# EAGLE design NPMDriver (EAGLE 6.5.0)
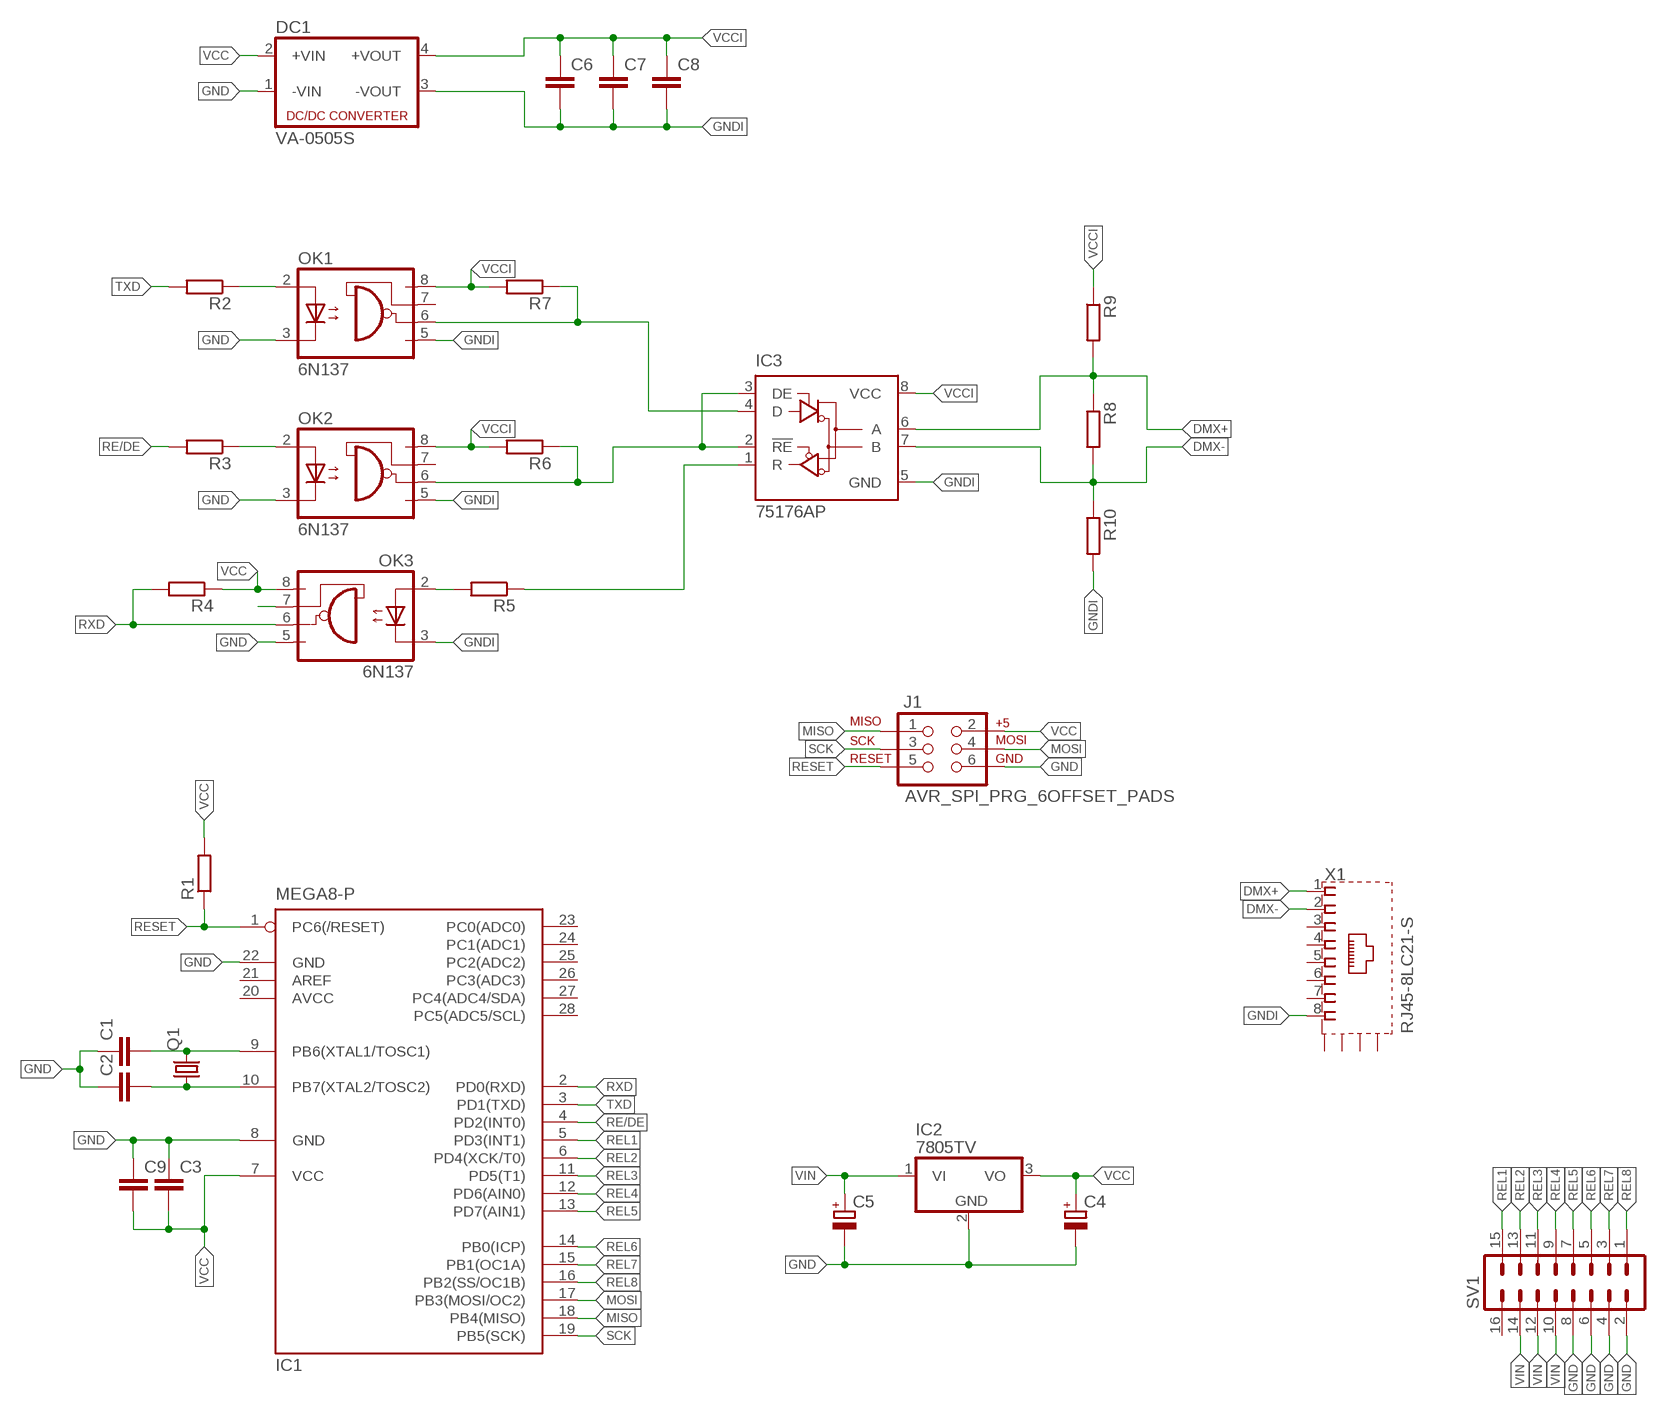
[diagram p0: schematic, sheet 1]

## Parts
C1  C-EU025-025X050  [C025-025X050]
C2  C-EU025-025X050  [C025-025X050]
C3  C-EU050-035X075  [C050-035X075]
C4  CPOL-EUE5-8.5  [E5-8,5]
C5  CPOL-EUE5-8.5  [E5-8,5]
C6  C-EU050-035X075  [C050-035X075]
C7  C-EU050-035X075  [C050-035X075]
C8  C-EU050-035X075  [C050-035X075]
C9  C-EU050-035X075  [C050-035X075]
DC1  VA-0505S  [4SIL]
IC1  MEGA8-P  [DIL28-3]
IC2  7805TV  [TO220V]
IC3  75176AP  [DIL08]
J1  AVR_SPI_PRG_6OFFSET_PADS  [2X3_OFFSET]
OK1  6N137  [DIL08]
OK2  6N137  [DIL08]
OK3  6N137  [DIL08]
Q1  CRYSTALHC49S  [HC49/S]
R1  R-EU_0207/10  [0207/10]
R2  R-EU_0207/10  [0207/10]
R3  R-EU_0207/10  [0207/10]
R4  R-EU_0207/10  [0207/10]
R5  R-EU_0207/10  [0207/10]
R6  R-EU_0207/10  [0207/10]
R7  R-EU_0207/10  [0207/10]
R8  R-EU_0207/10  [0207/10]
R9  R-EU_0207/10  [0207/10]
R10  R-EU_0207/10  [0207/10]
SV1  ML163M  [3M_16]
X1  RJ45-8LC21-S  [RJ45-SHIELD1]

## Nets
DMX+: IC3.6(A) R8.1 R9.2 X1.1
DMX-: IC3.7(B) R8.2 R10.1 X1.2
GND: C1.1 C2.1 C3.1 C4.- C5.- C9.1 DC1.1(-VIN) IC1.8(GND) IC1.22(GND) IC2.2(GND) J1.6 OK1.3(C) OK2.3(C) OK3.5(GND) SV1.2 SV1.4 SV1.6 SV1.8
GNDI: C6.2 C7.2 C8.2 DC1.3(-VOUT) IC3.5(GND) OK1.5(GND) OK2.5(GND) OK3.3(C) R10.2 X1.8
MISO: IC1.18(PB4(MISO)) J1.1
MOSI: IC1.17(PB3(MOSI/OC2)) J1.4
N$1: C2.2 IC1.10(PB7(XTAL2/TOSC2)) Q1.1
N$2: C1.2 IC1.9(PB6(XTAL1/TOSC1)) Q1.2
N$3: OK1.2(A) R2.1
N$4: OK3.2(A) R5.2
N$5: OK2.2(A) R3.1
N$6: OK3.7(VE)
N$7: IC3.1(R) R5.1
N$8: IC3.4(D) OK1.6(VO) R7.1
N$9: IC3.2(!RE) IC3.3(DE) OK2.6(VO) R6.1
RE/DE: IC1.4(PD2(INT0)) R3.2
REL1: IC1.5(PD3(INT1)) SV1.15
REL2: IC1.6(PD4(XCK/T0)) SV1.13
REL3: IC1.11(PD5(T1)) SV1.11
REL4: IC1.12(PD6(AIN0)) SV1.9
REL5: IC1.13(PD7(AIN1)) SV1.7
REL6: IC1.14(PB0(ICP)) SV1.5
REL7: IC1.15(PB1(OC1A)) SV1.3
REL8: IC1.16(PB2(SS/OC1B)) SV1.1
RESET: IC1.1(PC6(/RESET)) J1.5 R1.1
RXD: IC1.2(PD0(RXD)) OK3.6(VO) R4.2
SCK: IC1.19(PB5(SCK)) J1.3
TXD: IC1.3(PD1(TXD)) R2.2
VCC: C3.2 C4.+ C9.2 DC1.2(+VIN) IC1.7(VCC) IC2.3(VO) J1.2 OK3.8(VCC) R1.2 R4.1
VCCI: C6.1 C7.1 C8.1 DC1.4(+VOUT) IC3.8(VCC) OK1.8(VCC) OK2.8(VCC) R6.2 R7.2 R9.1
VIN: C5.+ IC2.1(VI) SV1.10 SV1.12 SV1.14
Unconnected: IC1.21(AREF) IC1.23(PC0(ADC0)) IC1.24(PC1(ADC1)) IC1.25(PC2(ADC2)) IC1.26(PC3(ADC3)) IC1.27(PC4(ADC4/SDA)) IC1.28(PC5(ADC5/SCL)) OK1.7(VE) OK2.7(VE) SV1.16 X1.3 X1.4 X1.5 X1.6 X1.7 X1.S1(S) X1.S2(S) X1.S3(S) X1.S4(S)

## Power pins joined to a net without a drawn wire
AVCC: IC1.20(AVCC)

## Library data of the parts
C1-C3 C6-C9 = rcl:C-EU: CAPACITOR, European symbol
C4 C5 = rcl:CPOL-EU: POLARIZED CAPACITOR, European symbol
DC1 = dc-dc-converter:VA-*?: DC DC Converter Single Output, 1 Watt Motien Technology Co.,Ltd. Source: va-serie.pdf; OC_FARNELL: unknown; OC_NEWARK: unknown
IC1 = atmel:MEGA8-P: MICROCONTROLLER 8 Kbytes FLASH, 1 kbytes SRAM, 512 bytes EEPROM, USART, 4-channel 10 bit ADC, 2-channel 8 bit ADC Pin compatible with Atmega48, ATMega88, ATMega168 Source: avr.lbr; OC_FARNELL: unknown; OC_NEWARK: unknown
IC2 = linear:78*: Positive VOLTAGE REGULATOR Source: http://cache.national.com/ds/LM/LM78L05.pdf http://www.fairchildsemi.com/ds/LM/LM7805.pdf
IC3 = 751xx:75176A: DIFFERENTIAL BUS TRANSCEIVER Source: http://focus.ti.com/lit/ds/symlink/sn75176a.pdf
J1 = SparkFun:AVR_SPI_PRG_6: AVR ISP 6 Pin This is the reduced ISP connector for AVR programming. Common on Arduino. This footprint will take up less PCB space and can be used with a 10-pin to 6-pin adapter such as SKU: BOB-08508
OK1-OK3 = optocoupler:6N137: MOTOROLA OPTO COUPLER; MPN: 6N137; OC_FARNELL: 1328376; OC_NEWARK: 52M1895
Q1 = crystal:CRYSTAL: CRYSTAL; OC_FARNELL: 1667008; OC_NEWARK: unknown
R1-R10 = rcl:R-EU_: RESISTOR, European symbol
SV1 = con-harting-ml:ML16: HARTING; OC_FARNELL: unknown; OC_NEWARK: unknown
X1 = con-tycoelectronics:RJ45*2: RJ45 Low Profile Shield Type 2 For all RJ45 L, LC, LCT and X Series Models Source: www.tycoelectronics.com .. ENG_DS_1654001_1099_RJ_L_0507.pdf; OC_FARNELL: unknown; OC_NEWARK: unknown

## Board
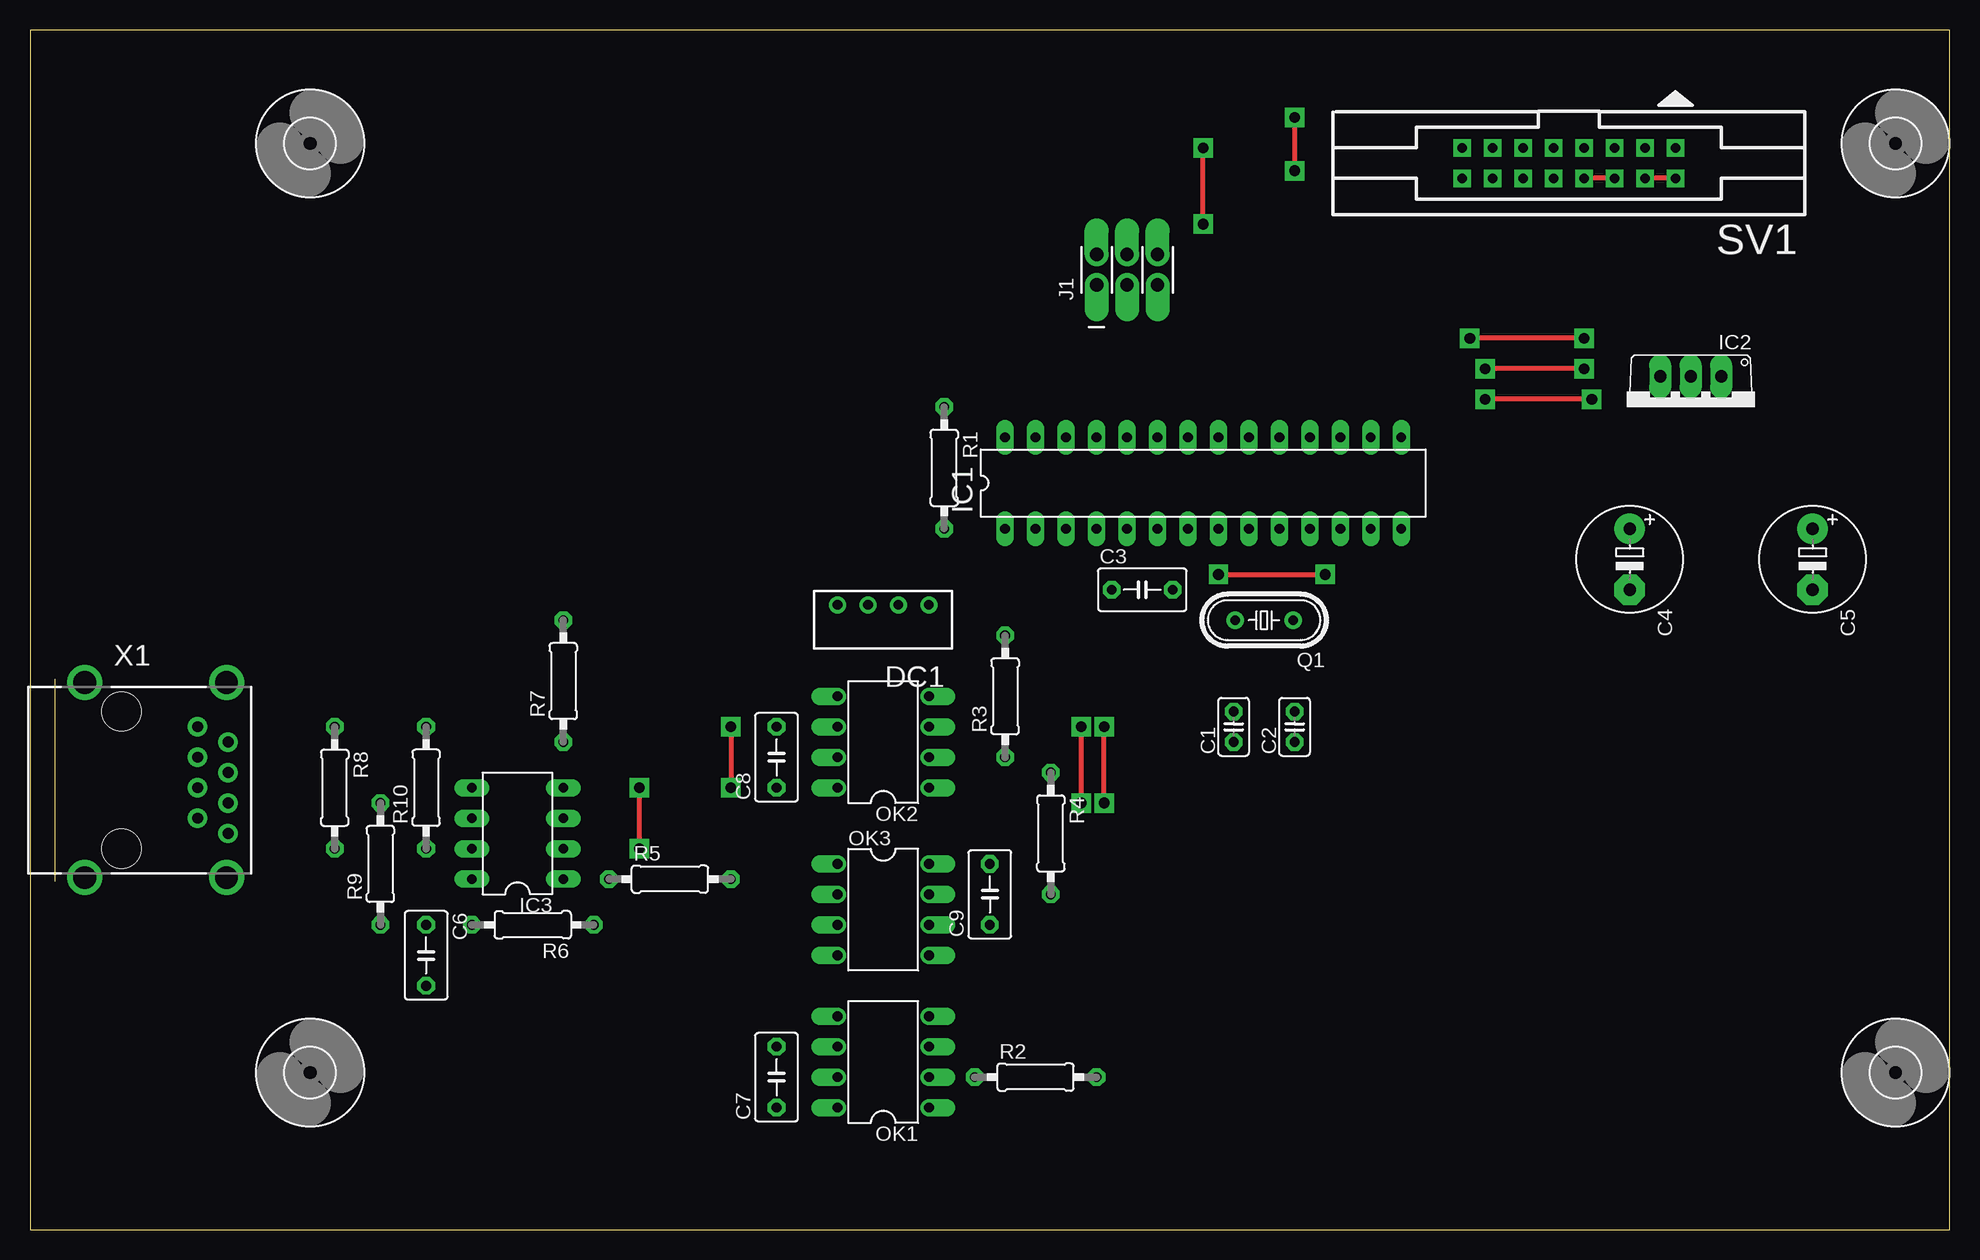
[diagram p1: board, top side]
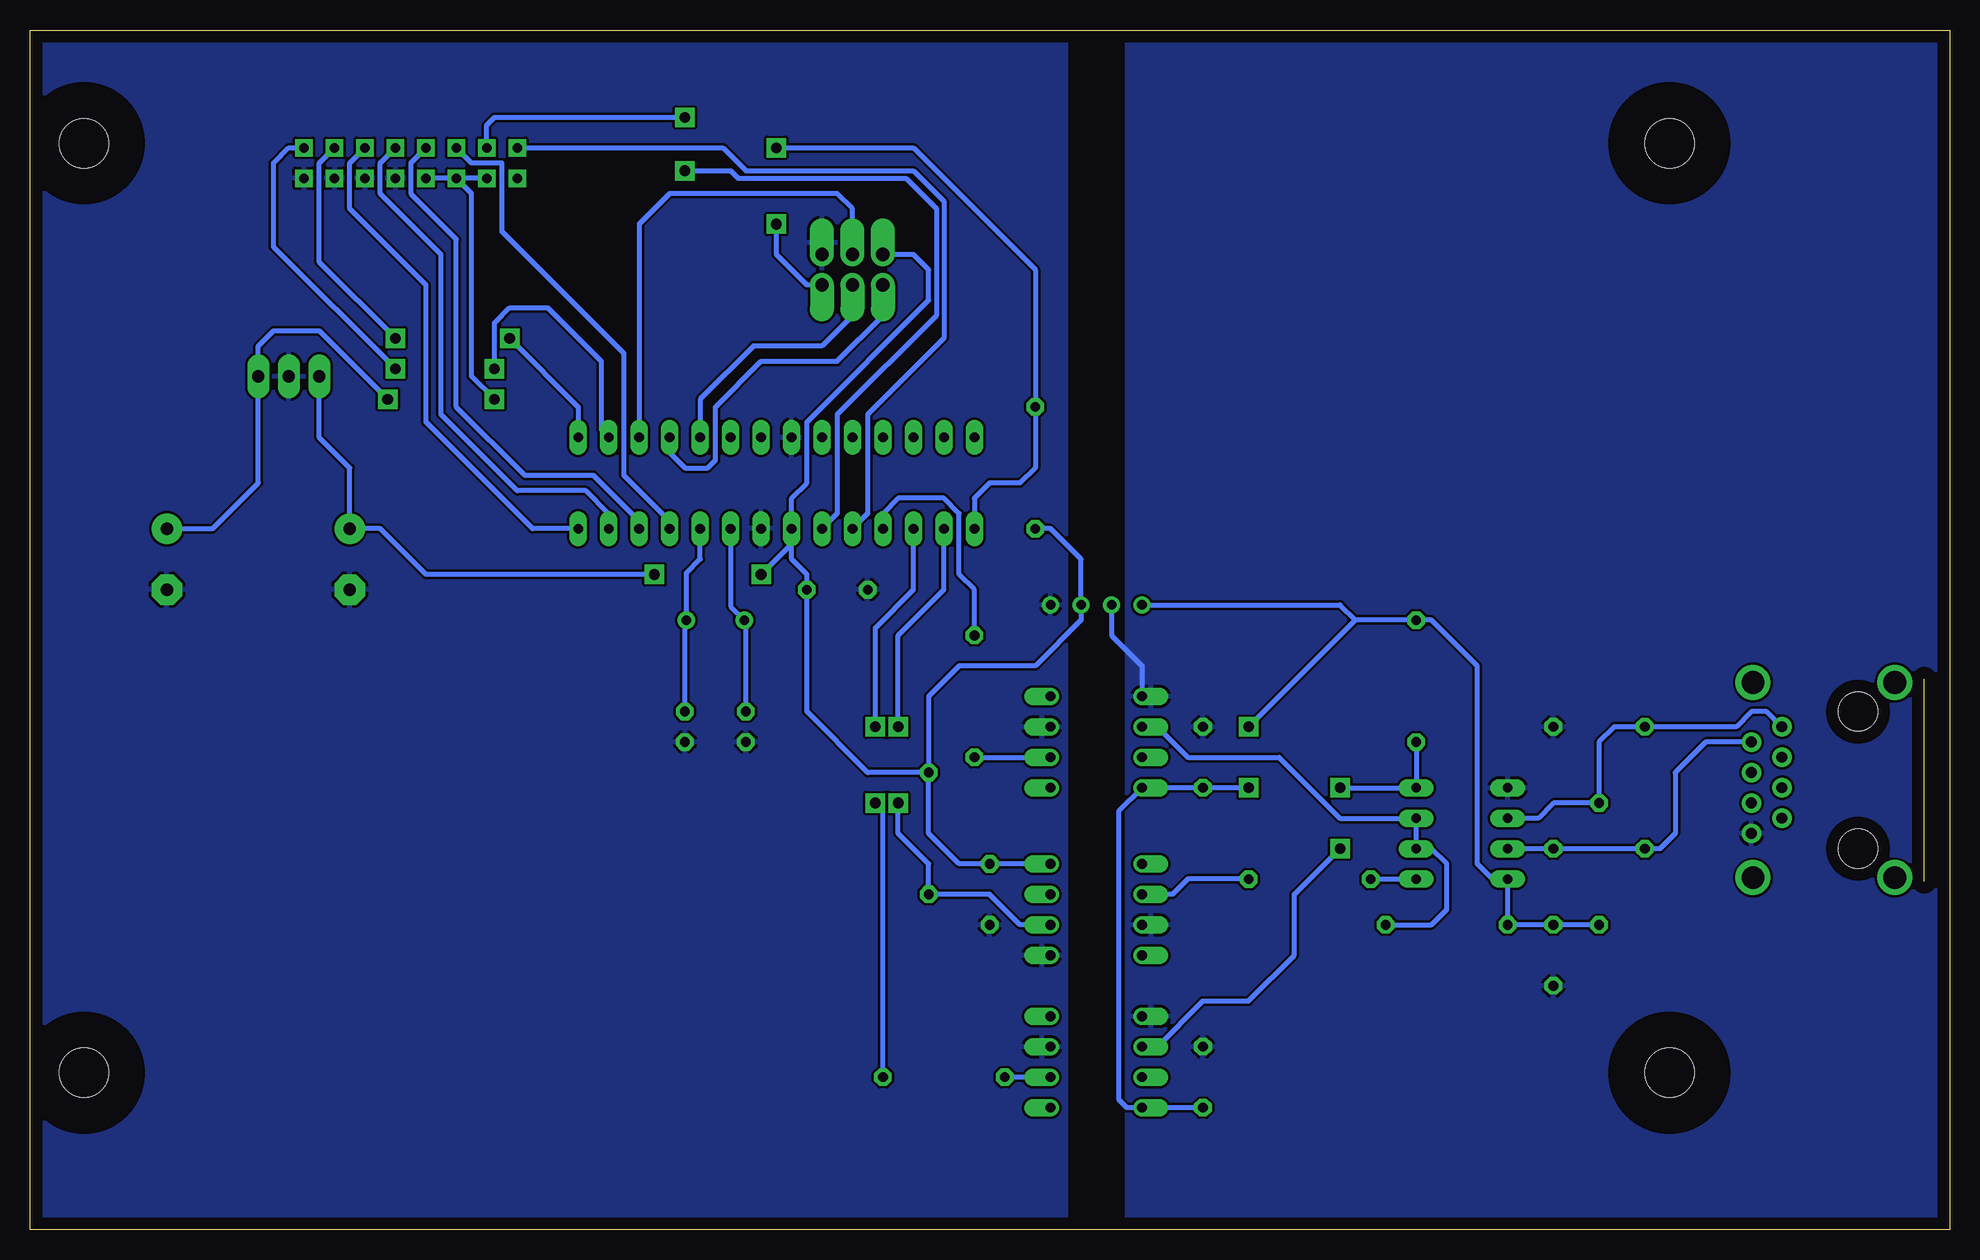
[diagram p2: board, bottom side, seen from below]

Size 160 x 100 mm. Coordinates in mm from the lower left corner, seen from the top.
Outline: 0,0 160,0 160,100 0,100 0,0
Copper layers (1*16): Top 0.035mm / dielectric 1.5mm / Bottom 0.035mm
Design rules "default *": minimum track width 10mil, minimum drill 24mil, track to track 8mil, track to pad 8mil, pad to pad 8mil, via to via 8mil, smd to smd 8mil, copper to edge 40mil, drill to drill 8mil, minimum pad ring 10mil, minimum via ring 10mil, stop-mask expansion 4mil, vias tented up to drill 0mil, thermal gap 10mil

### Footprints (pad centres in the part's own frame; a part is rotated, then mirrored left to right if it is on the bottom)
C025-025X050 = drill 0.813 octagon: 1 -1.27,0; 2 1.27,0
C050-035X075 = drill 0.813 octagon: 1 -2.54,0; 2 2.54,0
E5-8,5 = drill 1.016 pad 2.54: + -2.54,0 | drill 1.016 pad 2.54 octagon: - 2.54,0
4SIL = drill 0.8: 1 -3.81,0; 2 -1.27,0; 3 1.27,0; 4 3.81,0
DIL28-3 = drill 0.813 long: 1 -16.51,-3.81; 2 -13.97,-3.81; 3 -11.43,-3.81; 4 -8.89,-3.81; 5 -6.35,-3.81; 6 -3.81,-3.81; 7 -1.27,-3.81; 8 1.27,-3.81; 9 3.81,-3.81; 10 6.35,-3.81; 11 8.89,-3.81; 12 11.43,-3.81; 13 13.97,-3.81; 14 16.51,-3.81; 15 16.51,3.81; 16 13.97,3.81; 17 11.43,3.81; 18 8.89,3.81; 19 6.35,3.81; 20 3.81,3.81; 21 1.27,3.81; 22 -1.27,3.81; 23 -3.81,3.81; 24 -6.35,3.81; 25 -8.89,3.81; 26 -11.43,3.81; 27 -13.97,3.81; 28 -16.51,3.81
TO220V = drill 1.016 long: 1 -2.54,-2.54; 2 0,-2.54; 3 2.54,-2.54
DIL08 = drill 0.813 long: 1 -3.81,-3.81; 2 -1.27,-3.81; 3 1.27,-3.81; 4 3.81,-3.81; 5 3.81,3.81; 6 1.27,3.81; 7 -1.27,3.81; 8 -3.81,3.81
2X3_OFFSET = drill 1.118 pad 1.88 offset: 1 -2.54,-1.27; 2 -2.54,1.27; 3 0,-1.27; 4 0,1.27; 5 2.54,-1.27; 6 2.54,1.27
DIL08' = drill 0.813 offset: 1 -3.81,-3.81; 2 -1.27,-3.81; 3 1.27,-3.81; 4 3.81,-3.81; 5 3.81,3.81; 6 1.27,3.81; 7 -1.27,3.81; 8 -3.81,3.81
HC49/S = drill 0.813: 1 -2.413,0; 2 2.413,0
0207/10 = drill 0.813 octagon: 1 -5.08,0; 2 5.08,0
3M_16 = drill 0.813 square: 1 -8.89,-1.27; 2 -8.89,1.27; 3 -6.35,-1.27; 4 -6.35,1.27; 5 -3.81,-1.27; 6 -3.81,1.27; 7 -1.27,-1.27; 8 -1.27,1.27; 9 1.27,-1.27; 10 1.27,1.27; 11 3.81,-1.27; 12 3.81,1.27; 13 6.35,-1.27; 14 6.35,1.27; 15 8.89,-1.27; 16 8.89,1.27
4,1 = hole 4.1: 0,0
RJ45-SHIELD1 = drill 0.9 pad 1.4: 1 -4.445,6.35; 2 -3.175,8.89; 3 -1.905,6.35; 4 -0.635,8.89; 5 0.635,6.35; 6 1.905,8.89; 7 3.175,6.35; 8 4.445,8.89 | drill 1.9 pad 2.5: S1 -8.128,-3.048; S2 8.128,-3.048; S3 -8.128,8.76; S4 8.128,8.76 | hole 3.251: -5.715,0; 5.715,0

### Placement (x,y rotation side)
C1  100.33,41.91 90 top
C2  105.41,41.91 90 top
C3  92.71,53.34 0 top
C4  133.35,55.88 270 top
C5  148.59,55.88 270 top
C6  33.02,22.86 270 top
C7  62.23,12.7 90 top
C8  62.23,39.37 90 top
C9  80.01,27.94 90 top
DC1  71.12,52.07 180 top
IC1  97.79,62.23 0 top
IC2  138.43,68.58 180 top
IC3  40.64,33.02 90 top
J1  91.44,80.01 0 top
OK1  6N137  [DIL08']  71.12,13.97 90 top
OK2  6N137  [DIL08']  71.12,40.64 90 top
OK3  6N137  [DIL08']  71.12,26.67 270 top
Q1  102.87,50.8 180 top
R1  76.2,63.5 270 top
R2  83.82,12.7 0 top
R3  81.28,44.45 90 top
R4  85.09,33.02 270 top
R5  53.34,29.21 0 top
R6  41.91,25.4 180 top
R7  44.45,45.72 90 top
R8  25.4,36.83 270 top
R9  29.21,30.48 90 top
R10  33.02,36.83 90 top
SV1  128.27,88.9 180 top
U$1  [4,1]  23.35,90.55 0 top
U$2  [4,1]  155.5,90.55 0 top
U$3  [4,1]  23.35,13.08 0 top
U$4  [4,1]  155.5,13.08 0 top
X1  7.62,37.47 270 top

### Tracks (layer width: path | path; a pad name or v marks a point on that pad's centre or on a via)
DMX+
  Bottom 0.406: X1.1 15.24,43.18 16.51,43.18 17.78,41.91 R8.1 27.94,41.91 29.21,40.64 R9.2 33.02,35.56 34.29,34.29 IC3.6
DMX-
  Bottom 0.406: X1.2 20.32,40.64 22.86,38.1 22.86,33.02 24.13,31.75 R8.2 R10.1 IC3.7
GND
  Top 0.406: SV1.2 SV1.4 | SV1.6 SV1.8
  pour Bottom: 160.02,0 73.66,0 73.66,100.33 160.02,100.33
GNDI
  Bottom 0.406: DC1.3 69.85,49.53 67.31,46.99 OK2.5
  pour Bottom: 68.58,0 0,0 0,99.06 68.58,99.06
MISO
  Bottom 0.406: IC1.18 106.68,64.77 105.41,63.5 103.5,63.5 102.87,64.14 102.87,68.58 99.06,72.39 92.71,72.39 88.9,76.2 J1.1
MOSI
  Bottom 0.406: J1.4 91.44,85.09 92.71,86.36 106.68,86.36 109.22,83.82 IC1.17
N$1
  Bottom 0.406: IC1.10 104.14,55.88 105.28,54.74 Q1.1 105.41,50.67 C2.2
N$2
  Bottom 0.406: IC1.9 101.6,51.94 Q1.2 100.33,50.67 C1.2
N$3
  Bottom 0.406: OK1.2 R2.1
N$4
  Bottom 0.406: R5.2 63.5,29.21 64.77,27.94 OK3.2
N$5
  Bottom 0.406: R3.1 OK2.2
N$7
  Bottom 0.406: R5.1 IC3.1
N$8  (via drill 0.9)
  Top 0.406: v50.8,31.75 v50.8,36.83
  Bottom 0.406: R7.1 IC3.4 v50.8,36.83 | OK1.6 66.04,15.24 62.23,19.05 58.42,19.05 54.61,22.86 54.61,27.94 v50.8,31.75
N$9
  Bottom 0.406: R6.1 43.18,25.4 41.91,26.67 41.91,30.48 43.18,31.75 IC3.2 IC3.3 50.8,34.29 55.88,39.37 63.5,39.37 66.04,41.91 OK2.6
RE/DE
  Bottom 0.406: R3.2 81.28,53.34 82.55,54.61 82.55,59.69 83.82,60.96 87.63,60.96 88.9,59.69 IC1.4
REL1
  Bottom 0.406: SV1.15 102.23,90.17 100.33,88.27 86.36,88.27 83.82,85.72 83.82,74.3 90.17,67.94 90.17,59.69 IC1.5
REL2  (via drill 0.9)
  Top 0.406: v105.41,92.71 v105.41,88.27
  Bottom 0.406: IC1.6 92.71,59.69 92.71,67.94 84.45,76.2 84.45,85.09 87,87.63 100.97,87.63 101.6,88.27 v105.41,88.27 | SV1.13 121.92,92.08 121.28,92.71 v105.41,92.71
REL3
  Bottom 0.406: IC1.11 106.68,59.05 110.49,62.87 110.49,73.03 120.65,83.19 120.65,88.9 123.19,88.9 SV1.11
REL4
  Bottom 0.406: IC1.12 109.22,59.05 113.03,62.87 118.75,62.87 124.46,68.58 124.46,82.55 128.27,86.36 128.27,88.9 SV1.9
REL5
  Bottom 0.406: IC1.13 111.76,59.69 113.67,61.59 119.38,61.59 125.73,67.94 125.73,81.28 130.81,86.36 130.81,88.9 SV1.7
REL6
  Bottom 0.406: IC1.14 118.11,58.42 127,67.31 127,78.74 133.35,85.09 133.35,88.9 SV1.5
REL7  (via drill 0.9)
  Top 0.406: v129.54,74.3 v120.02,74.3
  Bottom 0.406: v129.54,74.3 135.89,80.64 135.89,88.9 SV1.3 | v120.02,74.3 114.3,68.58 IC1.15
REL8  (via drill 0.9)
  Top 0.406: v129.54,71.75 v121.28,71.75
  Bottom 0.406: v129.54,71.75 139.7,81.92 139.7,88.9 138.43,90.17 SV1.1 | v121.28,71.75 121.28,75.56 120.02,76.83 116.84,76.83 112.39,72.39 112.39,66.67 IC1.16
RESET  (via drill 0.9)
  Top 0.406: v97.79,83.82 v97.79,90.17
  Bottom 0.406: IC1.1 81.28,60.96 80.01,62.23 77.47,62.23 76.2,63.5 R1.1 76.2,80.01 86.36,90.17 v97.79,90.17 | J1.5 95.25,78.74 97.79,81.28 v97.79,83.82
RXD  (via drill 0.9)
  Top 0.406: v87.63,35.56 v87.63,41.91
  Bottom 0.406: OK3.6 77.47,25.4 80.01,27.94 R4.2 85.09,30.48 87.63,33.02 v87.63,35.56 | v87.63,41.91 87.63,49.53 83.82,53.34 IC1.2
SCK
  Bottom 0.406: J1.3 91.44,76.2 93.98,73.66 99.69,73.66 104.14,69.22 IC1.19
TXD  (via drill 0.9)
  Top 0.406: v89.53,35.56 v89.53,41.91
  Bottom 0.406: R2.2 88.9,34.92 v89.53,35.56 | v89.53,41.91 89.53,50.16 86.36,53.34 IC1.3
VCC  (via drill 0.9)
  Top 0.406: v99.06,54.61 v107.95,54.61
  Bottom 0.406: OK3.8 C9.2 82.55,30.48 85.09,33.02 R4.1 | R1.2 74.93,58.42 72.39,55.88 DC1.2 72.39,50.8 76.2,46.99 82.55,46.99 85.09,44.45 R4.1 | IC1.7 96.52,55.88 95.25,54.61 C3.2 95.25,43.18 90.17,38.1 R4.1 | IC2.3 135.89,66.04 133.35,63.5 C4.+ 130.81,58.42 127,54.61 v107.95,54.61 | IC1.7 96.52,57.15 v99.06,54.61 | IC1.7 96.52,60.96 95.25,62.23 95.25,67.31 85.09,77.47 85.09,80.01 86.36,81.28 J1.2
VCCI  (via drill 0.9)
  Top 0.406: v58.42,41.91 v58.42,36.83
  Bottom 0.406: R9.1 C6.1 R6.2 IC3.8 38.1,29.21 39.37,30.48 39.37,46.99 43.18,50.8 R7.2 49.53,50.8 | C7.1 OK1.8 68.58,10.16 69.22,10.79 69.22,34.92 OK2.8 C8.1 v58.42,36.83 | 49.53,50.8 v58.42,41.91 | DC1.4 50.8,52.07 49.53,50.8
VIN  (via drill 0.9)
  Top 0.406: v130.18,69.22 v121.28,69.22
  Bottom 0.406: C5.+ 144.78,58.42 140.97,62.23 IC2.1 140.97,73.66 139.7,74.93 135.89,74.93 v130.18,69.22 | SV1.14 SV1.12 | SV1.12 SV1.10 | v121.28,69.22 123.19,71.12 123.19,86.36 SV1.12